# Altium project TRAVEH.PRJPCB
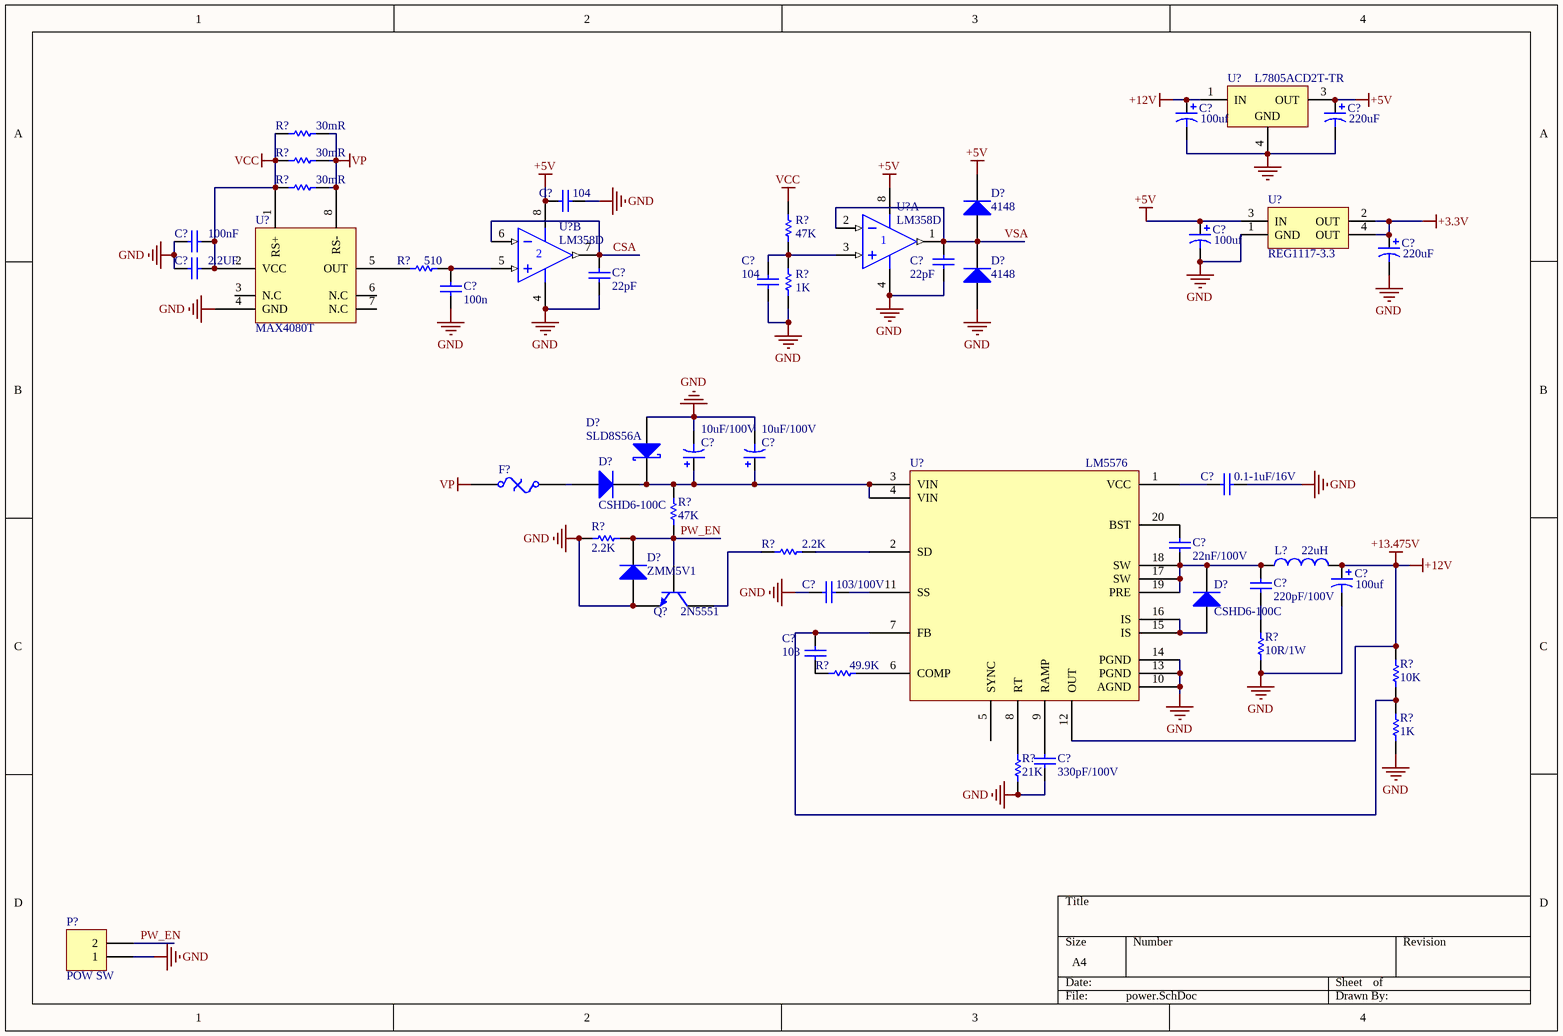
[diagram p0: power.SchDoc]
6 sheets, 138 parts. Net scope: global (net labels, ports and power ports of the same name join across sheets).
Board file: V1.1.PcbDoc
Sheets:
  power.SchDoc
  core.SchDoc
  signal.SchDoc
  hydraulic.SchDoc
  interface.SchDoc
  edison.SchDoc

## Sheet power.SchDoc
size A4

### Parts
(Parts that share a designator on the sheet are numbered #1, #2 ... from top to bottom, then left to right.)
C21  value 104  [0603]  (hidden comment: Cap)
C22  value 100nF  [R0805]  (hidden comment: Cap)
C23  value 2.2UF  [C-5.08]  (hidden comment: Cap)
C24  value 104  [0603]  (hidden comment: Cap)
C25  value 22pF  [0603]  (hidden comment: Cap)
C26  value 22pF  [0603]  (hidden comment: Cap)
C27  value 100n  [0603]  (hidden comment: Cap)
C?#1  value 100uf  [C8x4]  (hidden comment: Cap Pol1)
C?#2  value 220uF  [C8x4]  (hidden comment: Cap Pol1)
C?#3  value 100uf  [C8x4]  (hidden comment: Cap Pol1)
C?#4  value 220uF  [C8x4]  (hidden comment: Cap Pol1)
C?#5  value 10uF/100V  [C10-SMD]  (hidden comment: Cap Pol3)
C?#6  value 10uF/100V  [C10-SMD]  (hidden comment: Cap Pol3)
C?#7  value 0.1-1uF/16V  [0805]  (hidden comment: Cap)
C?#8  value 22nF/100V  [0805]  (hidden comment: Cap)
C?#9  value 100uf  [C8x4]  (hidden comment: Cap Pol1)
C?#10  value 220pF/100V  [0603]  (hidden comment: Cap)
C?#11  value 103/100V  [0603]  (hidden comment: Cap)
C?#12  value 103  [0603]  (hidden comment: Cap)
C?#13  value 330pF/100V  [0603]  (hidden comment: Cap)
D11  4148  [LL34]
D12  4148  [LL34]
D?#1  SLD8S56A  [SMTO-263]
D?#2  CSHD6-100C  [LL34]
D?#3  ZMM5V1  [LL34]
D?#4  CSHD6-100C  [LL34]
F?  Fuse Thermal  [FUSE-PTC]  (value not drawn)
L?#1  value 22uH  [L-6045]  (hidden comment: Inductor)
P?#1  POW SW  [HDR1X2]
Q?#1  value 2N5551  [SOT-23-NPN]  (hidden comment: NPN)
R50  value 30mR  [R15-1mm]
R51  value 30mR  [R15-1mm]
R52  value 30mR  [R15-1mm]
R53  value 47K  [R0805]  (hidden comment: Res1)
R54  value 510  [0603]  (hidden comment: Res1)
R55  value 1K  [R0805]  (hidden comment: Res1)
R?#1  value 47K  [0805]  (hidden comment: Res1)
R?#2  value 2.2K  [0805]  (hidden comment: Res1)
R?#3  value 2.2K  [0805]  (hidden comment: Res1)
R?#4  value 49.9K  [0603]  (hidden comment: Res1)
R?#5  value 10R/1W  [6332[2512]]  (hidden comment: Res1)
R?#6  value 10K  [0603]  (hidden comment: Res1)
R?#7  value 1K  [0603]  (hidden comment: Res1)
R?#8  value 21K  [0603]  (hidden comment: Res1)
U4  LM358D  [SOIC8]  (part B of 2)
U5  MAX4080T  [SOIC8]
U6  LM5576  [HTTSOP-20]
U?#1  L7805ACD2T-TR  [D2PAK]
U?#2  REG1117-3.3  [ZZ311]
U?#3  LM358D  [SOIC8]  (part A of 2)

### Nets
+3.3V: C?#4.1 U?#2.2(OUT) U?#2.4(OUT)
+5V: C21.2 C?#2.1 C?#3.1 D11.2(K) U4.8(V+) U?#1.3(OUT) U?#2.3(IN) U?#3.8(V+)
+12V: C?#1.1 C?#9.1 L?#1.2 R?#6.2 U6.12(OUT) U?#1.1(IN)  [also labelled +13.475V]
GND: C21.1 C22.1 C23.2 C24.2 C25.1 C26.1 C27.1 C?#1.2 C?#2.2 C?#3.2 C?#4.2 C?#5.2 C?#6.2 C?#7.1 C?#9.2 C?#11.2 C?#13.1 D12.1(A) D?#1.2(A) D?#3.1(A) P?#1.1 Q?#1.1(E) R55.1 R?#2.1 R?#5.1 R?#7.1 R?#8.1 U4.4(V-) U5.4(GND) U6.10(AGND) U6.13(PGND) U6.14(PGND) U?#1.2(GND) U?#1.4(GND) U?#2.1(GND) U?#3.4(V-)
VCC: C22.2 C23.1 R50.2 R51.2 R52.2 R53.2 U5.1(RS+) U5.2(VCC)
VP: F?.1 R50.1 R51.1 R52.1 U5.8(RS-)
CSA: C26.2 U4.6(IN-) U4.7(OUT)
PW_EN: D?#3.2(K) P?#1.2 Q?#1.2(B) R?#1.2 R?#2.2
VSA: C25.2 D11.1(A) D12.2(K) U?#3.1(OUT) U?#3.2(IN-)
NetC24_1: C24.1 R53.1 R55.2 U?#3.3(IN+)
NetC27_2: C27.2 R54.1 U4.5(IN+)
NetC?#5_1: C?#5.1 C?#6.1 D?#1.1(K) D?#2.2(K) R?#1.1 U6.3(VIN) U6.4(VIN)
NetC?#7_2: C?#7.2 U6.1(VCC)
NetC?#8_1: C?#8.1 U6.20(BST)
NetC?#8_2: C?#8.2 C?#10.2 D?#4.2(K) L?#1.1 U6.17(SW) U6.18(SW) U6.19(PRE)
NetC?#10_1: C?#10.1 R?#5.2
NetC?#11_1: C?#11.1 U6.11(SS)
NetC?#12_1: C?#12.1 R?#6.1 R?#7.2 U6.7(FB)
NetC?#12_2: C?#12.2 R?#4.1
NetC?#13_2: C?#13.2 U6.9(RAMP)
NetD?#2_1: D?#2.1(A) F?.2
NetD?#4_1: D?#4.1(A) U6.15(IS) U6.16(IS)
NetQ?#1_3: Q?#1.3(C) R?#3.1
NetR54_2: R54.2 U5.5(OUT)
NetR?#3_2: R?#3.2 U6.2(SD)
NetR?#4_2: R?#4.2 U6.6(COMP)
NetR?#8_2: R?#8.2 U6.8(RT)

Not connected (* = marked no-connect by the designer): U5 3(N.C) 6(N.C) 7(N.C); U6 5(SYNC)

### Library data of the parts
C21-C27 C?#7 C?#8 C?#10-C?#13 = Cap: Capacitor; Published: 8-Jun-2000; LatestRevisionDate: 17-Jul-2002; LatestRevisionNote: Re-released for DXP Platform.; PackageReference: RB7.6-15; Publisher: Altium Limited
C?#1-C?#4 C?#9 = Cap Pol1: Polarized Capacitor (Radial); Published: 8-Jun-2000; LatestRevisionDate: 17-Jul-2002; LatestRevisionNote: Re-released for DXP Platform.; PackageReference: RAD-0.3; Publisher: Altium Limited
C?#5 C?#6 = Cap Pol3: Polarized Capacitor (Surface Mount); Published: 8-Jun-2000; LatestRevisionDate: 17-Jul-2002; LatestRevisionNote: Re-released for DXP Platform.; PackageReference: C0805; Publisher: Altium Limited
D11 D12 D?#2-D?#4 = Diode 1N5408: 3 Amp Medium Power Silicon Rectifier Diode; Value: 1N4148; Published: 8-Jun-2000; LatestRevisionDate: 17-Jul-2002; LatestRevisionNote: Re-released for DXP Platform.; DatasheetDocument: Aug-1984; PackageReference: DO-201AD; Publisher: Altium Limited; ComponentLink1Description: Manufacturer Link; ComponentLink1URL: http://www.irf.com/
D?#1 = Diode 18TQ045: Schottky Rectifier; Note: Terminal 2 is the TAB and is electrically connected to the cathode; Value: SMBJ45CA; Published: 8-Jun-2000; LatestRevisionDate: 17-Jul-2002; LatestRevisionNote: Re-released for DXP Platform.; DatasheetDocument: Dec-1997; PackageDocument: Feb-1998; PackageReference: TO-220AC; Publisher: Altium Limited; ComponentLink1Description: Manufacturer Link; ComponentLink1URL: http://www.irf.com/; ComponentLink2Description: Datasheet; ComponentLink2URL: http://www.irf.com/product-info/datasheets/data/18tq.pdf
F? = Fuse Thermal: Thermal Fuse; Published: 24-Mar-1999; LatestRevisionDate: 17-Jul-2002; LatestRevisionNote: Re-released for DXP Platform.; PackageReference: PIN-W2/E2.8; Publisher: Altium Limited
L?#1 = Inductor: Code_IEC: 1005; Published: 8-Jun-2000; LatestRevisionDate: 17-Jul-2002; LatestRevisionNote: Re-released for DXP Platform.; PackageReference: 0402-A; Publisher: Altium Limited; Code_JEITA: 0402
P?#1 = Header 2: Header, 2-Pin; LatestRevisionDate: 17-Jul-2002; LatestRevisionNote: Re-released for DXP Platform.; Publisher: Altium Limited
Q?#1 = 2N5551: NPN General Purpose Amplifier; Published: 8-Jun-2000; LatestRevisionDate: 17-Jan-2003; LatestRevisionNote: PCB Footprint 'BCY-W3/D4.7' replaced; DatasheetDocument: 1997; PackageDocument: Sep-1998; PackageReference: TO-92A; Publisher: Altium Limited; ComponentLink1Description: Manufacturer Link; ComponentLink1URL: http://www.fairchildsemi.com/; ComponentLink2Description: Datasheet; ComponentLink2URL: http://www.fairchildsemi.com/ds/2N%2F2N5551.pdf
R50-R55 R?#1-R?#8 = Res1: Resistor
U4 U?#3 = LM358D: Dual Low-Power Operational Amplifier
U5 = MAX4080
U?#1 = MC78M05ACDTRK: Three-Terminal Medium Current Positive Voltage Regulator; Note: Pin 2 is electrically connected to Pin 4; Pin 2 is trimmed and not drawn;; Published: 15-Apr-2002; DatasheetVersion: Apr-2000; PackageVersion: 1997; PackageReference: 369A-13; Publisher: Altium Limited; PackageDescription: D-PAK/TO-252-AA; 3 Leads (1 Cropped); Body 10.3 (inc. leads) x 6.7 mm (LxW max); ComponentLink1Description: Manufacturer Link; ComponentLink1URL: http://www.onsemi.com/site/products/taxonomy/0,4438,503,00.html; ComponentLink2Description: Datasheet; ComponentLink2URL: http://www.onsemi.com/pub/Collateral/MC78M00-D.PDF
U?#2 = REG1117-3.3: 800mA and 1A Low Dropout Positive Regulator 2.85V, 3.3V, 5V, and Adjustable; Published: 8-Jun-2000; LatestRevisionDate: 17-Jul-2002; LatestRevisionNote: Re-released for DXP Platform.; DatasheetVersion: Sep-1997; PackageVersion: revC; PackageReference: ZZ311; Publisher: Altium Limited; PackageDescription: SOT-223/SC-73; 4 Leads; Body 6.7 x 7.3 mm, inc. leads (LxW max); ComponentLink1Description: Manufacturer Link; ComponentLink1URL: http://www.ti.com/; ComponentLink2Description: Datasheet; ComponentLink2URL: http://www-s.ti.com/sc/ds/REG1117.pdf

## Sheet core.SchDoc
size A4
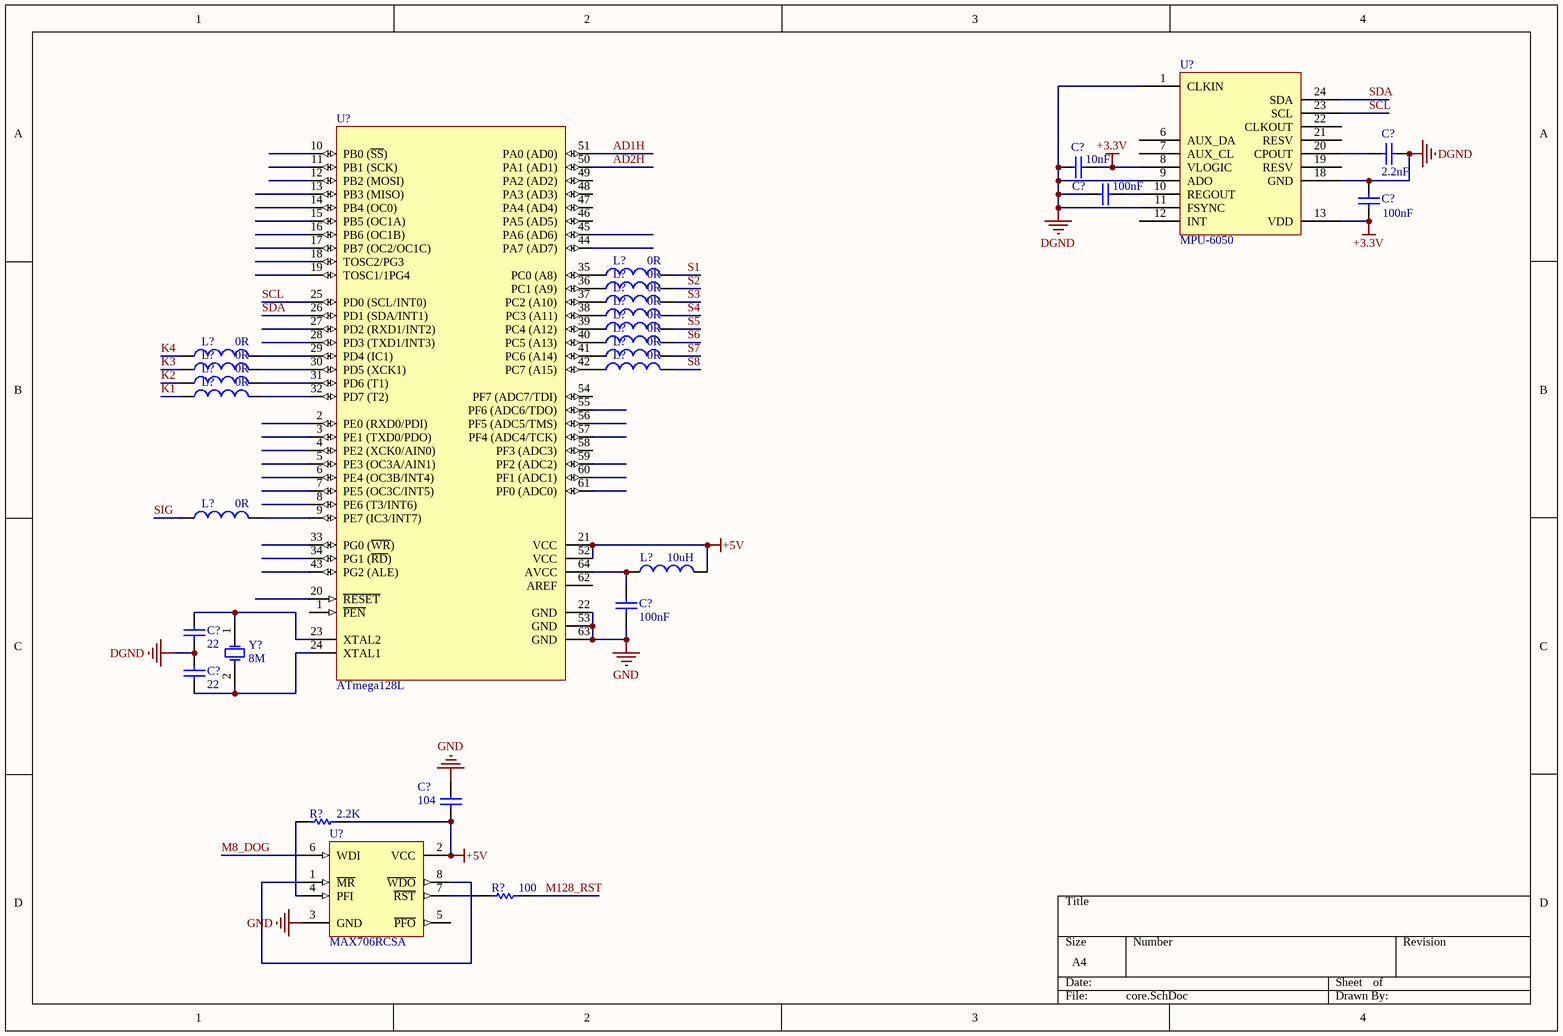
[diagram p1: core.SchDoc]

### Parts
(Parts that share a designator on the sheet are numbered #1, #2 ... from top to bottom, then left to right.)
C?#14  value 10nF  [0603]  (hidden comment: Cap)
C?#15  value 2.2nF  [0603]  (hidden comment: Cap)
C?#16  value 100nF  [0603]  (hidden comment: Cap)
C?#17  value 100nF  [0603]  (hidden comment: Cap)
C?#18  value 100nF  [0603]  (hidden comment: Cap)
C?#19  value 22  [0603]  (hidden comment: Cap)
C?#20  value 22  [0603]  (hidden comment: Cap)
C?#21  value 104  [0603]  (hidden comment: Cap)
L16  value 10uH  [0603]  (hidden comment: Inductor)
L19  value 0R  [0603]  (hidden comment: Inductor)
L?#2  value 0R  [0603]  (hidden comment: Inductor)
L?#3  value 0R  [0603]  (hidden comment: Inductor)
L?#4  value 0R  [0603]  (hidden comment: Inductor)
L?#5  value 0R  [0603]  (hidden comment: Inductor)
L?#6  value 0R  [0603]  (hidden comment: Inductor)
L?#7  value 0R  [0603]  (hidden comment: Inductor)
L?#8  value 0R  [0603]  (hidden comment: Inductor)
L?#9  value 0R  [0603]  (hidden comment: Inductor)
L?#10  value 0R  [0603]  (hidden comment: Inductor)
L?#11  value 0R  [0603]  (hidden comment: Inductor)
L?#12  value 0R  [0603]  (hidden comment: Inductor)
L?#13  value 0R  [0603]  (hidden comment: Inductor)
R?#9  value 2.2K  [0603]  (hidden comment: Res1)
R?#10  value 100  [0603]  (hidden comment: Res1)
U?#4  value ATmega128L  [64A_N]  (hidden comment: IC)
U?#5  value MPU-6050  [QFN50P400X400X95-24N]  (hidden comment: GYRO)
U?#6  MAX706RCSA  [SOIC8]
Y?  value 8M  [49SD]  (hidden comment: XTAL)

### Nets
+3.3V: C?#14.2 C?#17.1 U?#5.8(VLOGIC) U?#5.13(VDD)
+5V: C?#21.2 L16.2 R?#9.2 U?#4.21(VCC) U?#4.52(VCC) U?#6.2(VCC)
DGND: C?#14.1 C?#15.1 C?#16.2 C?#17.2 C?#19.1 C?#20.2 U?#5.1(CLKIN) U?#5.9(ADO) U?#5.11(FSYNC) U?#5.18(GND)
GND: C?#18.1 C?#21.1 U?#4.22(GND) U?#4.53(GND) U?#4.63(GND) U?#6.3(GND)
AD1H: U?#4.51(PA0_(AD0))
AD2H: U?#4.50(PA1_(AD1))
K1: L?#12.1
K2: L?#11.1
K3: L?#9.1
K4: L19.1
M8_DOG: U?#6.6(WDI)
M128_RST: R?#10.2
S1: L?#2.2
S2: L?#3.2
S3: L?#4.2
S4: L?#5.2
S5: L?#6.2
S6: L?#7.2
S7: L?#8.2
S8: L?#10.2
SCL: U?#4.25(PD0_(SCL/INT0)) U?#5.23(SCL)
SDA: U?#4.26(PD1_(SDA/INT1)) U?#5.24(SDA)
SIG: L?#13.1
NetC?#15_2: C?#15.2 U?#5.20(CPOUT)
NetC?#16_1: C?#16.1 U?#5.10(REGOUT)
NetC?#18_2: C?#18.2 L16.1 U?#4.64(AVCC)
NetC?#19_2: C?#19.2 U?#4.23(XTAL2) Y?.1(OSC1)
NetC?#20_1: C?#20.1 U?#4.24(XTAL1) Y?.2(OSC2)
NetL19_2: L19.2 U?#4.29(PD4_(IC1))
NetL?#2_1: L?#2.1 U?#4.35(PC0_(A8))
NetL?#3_1: L?#3.1 U?#4.36(PC1_(A9))
NetL?#4_1: L?#4.1 U?#4.37(PC2_(A10))
NetL?#5_1: L?#5.1 U?#4.38(PC3_(A11))
NetL?#6_1: L?#6.1 U?#4.39(PC4_(A12))
NetL?#7_1: L?#7.1 U?#4.40(PC5_(A13))
NetL?#8_1: L?#8.1 U?#4.41(PC6_(A14))
NetL?#9_2: L?#9.2 U?#4.30(PD5_(XCK1))
NetL?#10_1: L?#10.1 U?#4.42(PC7_(A15))
NetL?#11_2: L?#11.2 U?#4.31(PD6_(T1))
NetL?#12_2: L?#12.2 U?#4.32(PD7_(T2))
NetL?#13_2: L?#13.2 U?#4.9(PE7_(IC3/INT7))
NetR?#9_1: R?#9.1 U?#6.4(PFI)
NetR?#10_1: R?#10.1 U?#6.7(~{RST})
NetU?#6_1: U?#6.1(~{MR}) U?#6.8(~{WDO})

Not connected (* = marked no-connect by the designer): U?#4 1(~{PEN}) 2(PE0_(RXD0/PDI)) 3(PE1_(TXD0/PDO)) 4(PE2_(XCK0/AIN0)) 5(PE3_(OC3A/AIN1)) 6(PE4_(OC3B/INT4)) 7(PE5_(OC3C/INT5)) 8(PE6_(T3/INT6)) 10(PB0_(~{SS})) 11(PB1_(SCK)) 12(PB2_(MOSI)) 13(PB3_(MISO)) 14(PB4_(OC0)) 15(PB5_(OC1A)) 16(PB6_(OC1B)) 17(PB7_(OC2/OC1C)) 18(TOSC2/PG3) 19(TOSC1/1PG4) 20(~{RESET}) 27(PD2_(RXD1/INT2)) 28(PD3_(TXD1/INT3)) 33(PG0_(~{WR})) 34(PG1_(~{RD})) 43(PG2_(ALE)) 44(PA7_(AD7)) 45(PA6_(AD6)) 46(PA5_(AD5)) 47(PA4_(AD4)) 48(PA3_(AD3)) 49(PA2_(AD2)) 54(PF7_(ADC7/TDI)) 55(PF6_(ADC6/TDO)) 56(PF5_(ADC5/TMS)) 57(PF4_(ADC4/TCK)) 58(PF3_(ADC3)) 59(PF2_(ADC2)) 60(PF1_(ADC1)) 61(PF0_(ADC0)) 62(AREF); U?#5 6(AUX_DA) 7(AUX_CL) 12(INT) 19(RESV) 21(RESV) 22(CLKOUT); U?#6 5(~{PFO})

### Library data of the parts
C?#14-C?#21 = Cap: Capacitor; Published: 8-Jun-2000; LatestRevisionDate: 17-Jul-2002; LatestRevisionNote: Re-released for DXP Platform.; PackageReference: RAD-0.3; Publisher: Altium Limited
L16 L19 L?#2-L?#13 = Inductor: Code_IEC: 1005; Published: 8-Jun-2000; LatestRevisionDate: 17-Jul-2002; LatestRevisionNote: Re-released for DXP Platform.; PackageReference: 0402-A; Publisher: Altium Limited; Code_JEITA: 0402
R?#9 R?#10 = Res1: Resistor; Published: 8-Jun-2000; LatestRevisionDate: 17-Jul-2002; LatestRevisionNote: Re-released for DXP Platform.; PackageReference: AXIAL-0.3; Publisher: Altium Limited
U?#4 = ATmega128L-8AI: 8-Bit AVR Microcontroller with 128K Bytes of In-System Programmable Flash Memory; Published: 17-Sep-2003; LatestRevisionDate: 13-Apr-2006; LatestRevisionNote: IPC-7351 Footprint Added.; DatasheetVersion: 2467G-AVR-09/02; PackageVersion: revB, Oct-2001; PackageReference: 64A; Publisher: Altium Limited; PackageDescription: 64-Pin Thin Quad Flat Pack 0.8 mm Pitch; Code_JEDEC: MS-026-AEB; ComponentLink1Description: Manufacturer Link; ComponentLink1URL: http://www.atmel.com; ComponentLink2Description: Datasheet; ComponentLink2URL: http://www.atmel.com/dyn/resources/prod_documents/doc2467.pdf
U?#5 = MPU-6000
U?#6 = MAX706RCSA: +3V Voltage Monitoring, Low-Cost, µP Supervisory Circuit; Published: 16-Jan-2001; LatestRevisionDate: 13-Apr-2006; LatestRevisionNote: IPC-7351 Footprint Added.; DatasheetVersion: Sep-1995; PackageReference: NSO8; Publisher: Altium Limited; PackageDescription: 8-Pin Small Outline Integrated Circuit 1.27 mm Pitch; Code_JEDEC: MS-012-AA; Code_IPC: SOIC127P600-8; ComponentLink1Description: Manufacturer Link; ComponentLink1URL: http://www.maxim-ic.com/; ComponentLink2Description: Datasheet; ComponentLink2URL: http://pdfserv.maxim-ic.com/en/ds/MAX706P-MAX708T.pdf
Y? = XTAL: Crystal Oscillator; Published: 8-Jun-2000; LatestRevisionDate: 17-Jul-2002; LatestRevisionNote: Re-released for DXP Platform.; PackageReference: R38; Publisher: Altium Limited

## Sheet signal.SchDoc
size A4
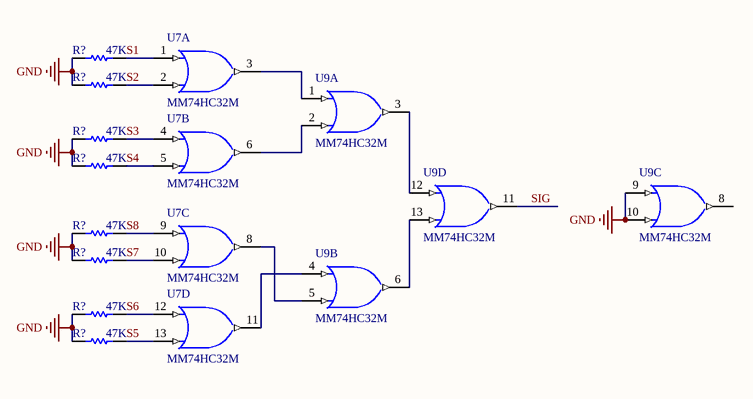
[diagram p2: signal.SchDoc]

### Parts
(Parts that share a designator on the sheet are numbered #1, #2 ... from top to bottom, then left to right.)
R?#11  value 47K  [0603]  (hidden comment: Res1)
R?#12  value 47K  [0603]  (hidden comment: Res1)
R?#13  value 47K  [0603]  (hidden comment: Res1)
R?#14  value 47K  [0603]  (hidden comment: Res1)
R?#15  value 47K  [0603]  (hidden comment: Res1)
R?#16  value 47K  [0603]  (hidden comment: Res1)
R?#17  value 47K  [0603]  (hidden comment: Res1)
R?#18  value 47K  [0603]  (hidden comment: Res1)
U7  MM74HC32M  [M14A_N]  (parts A,B,C,D of 4)
U9  MM74HC32M  [M14A_N]  (parts A,B,C,D of 4)

### Nets
+5V: U7.14(VCC) U9.14(VCC)
GND: R?#11.1 R?#12.1 R?#13.1 R?#14.1 R?#15.1 R?#16.1 R?#17.1 R?#18.1 U7.7(GND) U9.7(GND) U9.9(A) U9.10(B)
S1: R?#11.2 U7.1(A)
S2: R?#12.2 U7.2(B)
S3: R?#13.2 U7.4(A)
S4: R?#14.2 U7.5(B)
S5: R?#18.2 U7.13(B)
S6: R?#17.2 U7.12(A)
S7: R?#16.2 U7.10(B)
S8: R?#15.2 U7.9(A)
SIG: U9.11(Y)
NetU7_3: U7.3(Y) U9.1(A)
NetU7_6: U7.6(Y) U9.2(B)
NetU7_8: U7.8(Y) U9.5(B)
NetU7_11: U7.11(Y) U9.4(A)
NetU9_3: U9.3(Y) U9.12(A)
NetU9_6: U9.6(Y) U9.13(B)

Not connected (* = marked no-connect by the designer): U9 8(Y)

### Library data of the parts
R?#11-R?#18 = Res1: Resistor; Published: 8-Jun-2000; LatestRevisionDate: 17-Jul-2002; LatestRevisionNote: Re-released for DXP Platform.; PackageReference: AXIAL-0.3; Publisher: Altium Limited
U7 U9 = MM74HC32M: Quad 2-Input OR Gate; Published: 15-Apr-2002; LatestRevisionDate: 13-Apr-2006; LatestRevisionNote: IPC-7351 Footprint Added.; DatasheetVersion: 1988; PackageVersion: 2000; PackageReference: M14A; Publisher: Altium Limited; PackageDescription: 14-Pin Small Outline Integrated Circuit 1.27 mm Pitch; Code_IPC: SOIC127P600-14; ComponentLink1Description: Manufacturer Link; ComponentLink1URL: http://www.national.com/; ComponentLink2Description: Datasheet; ComponentLink2URL: http://www.fairchildsemi.com/ds/MM/MM74HC32.pdf; ComponentLink3Description: URL Link1; ComponentLink3URL: http://www.fairchildsemi.com/pf/MM/MM74HC32.html

## Sheet hydraulic.SchDoc
size A4
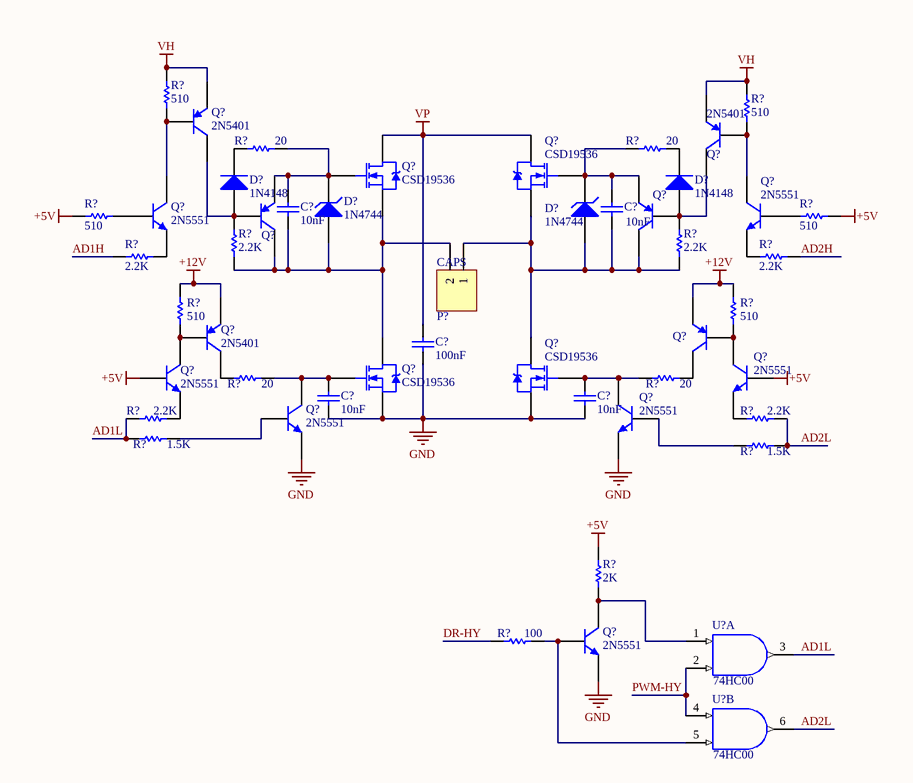
[diagram p3: hydraulic.SchDoc]

### Parts
(Parts that share a designator on the sheet are numbered #1, #2 ... from top to bottom, then left to right.)
C?#22  value 10nF  [R0805]  (hidden comment: Cap)
C?#23  value 10nF  [R0805]  (hidden comment: Cap)
C?#24  value 100nF  [C-5.08]  (hidden comment: Cap)
C?#25  value 10nF  [R0805]  (hidden comment: Cap)
C?#26  value 10nF  [R0805]  (hidden comment: Cap)
D?#5  1N4148  [LL34]
D?#6  1N4148  [LL34]
D?#7  1N4744  [LL34]
D?#8  1N4744  [LL34]
P?#2  CAPS  [MG7.62-2P]
Q?#2  2N5401  [SOT-23-PNP]
Q?#3  2N5401  [SOT-23-PNP]
Q?#4  CSD19536  [D2PAK]
Q?#5  CSD19536  [D2PAK]
Q?#6  2N5551  [SOT-23-NPN]
Q?#7  2N5401  [SOT-23-PNP]  (value not drawn)
Q?#8  2N5401  [SOT-23-PNP]  (value not drawn)
Q?#9  2N5551  [SOT-23-NPN]
Q?#10  2N5401  [SOT-23-PNP]
Q?#11  2N5401  [SOT-23-PNP]  (value not drawn)
Q?#12  2N5551  [SOT-23-NPN]
Q?#13  CSD19536  [D2PAK]
Q?#14  CSD19536  [D2PAK]
Q?#15  2N5551  [SOT-23-NPN]
Q?#16  2N5551  [SOT-23-NPN]
Q?#17  2N5551  [SOT-23-NPN]
Q?#18  2N5551  [SOT-23-NPN]
R?#19  value 510  [R0805]  (hidden comment: Res1)
R?#20  value 510  [R0805]  (hidden comment: Res1)
R?#21  value 20  [R0805]  (hidden comment: Res1)
R?#22  value 20  [R0805]  (hidden comment: Res1)
R?#23  value 510  [R0805]  (hidden comment: Res1)
R?#24  value 510  [R0805]  (hidden comment: Res1)
R?#25  value 2.2K  [R0805]  (hidden comment: Res1)
R?#26  value 2.2K  [R0805]  (hidden comment: Res1)
R?#27  value 2.2K  [R0805]  (hidden comment: Res1)
R?#28  value 2.2K  [R0805]  (hidden comment: Res1)
R?#29  value 510  [R0805]  (hidden comment: Res1)
R?#30  value 510  [R0805]  (hidden comment: Res1)
R?#31  value 20  [R0805]  (hidden comment: Res1)
R?#32  value 20  [R0805]  (hidden comment: Res1)
R?#33  value 2.2K  [R0805]  (hidden comment: Res1)
R?#34  value 2.2K  [R0805]  (hidden comment: Res1)
R?#35  value 1.5K  [R0805]  (hidden comment: Res1)
R?#36  value 1.5K  [R0805]  (hidden comment: Res1)
R?#37  value 2K  [0603]  (hidden comment: Res1)
R?#38  value 100  [0603]  (hidden comment: Res1)
U?#7  value 74HC00  [751A]  (hidden comment: IC)  (part A of 4)
U?#8  value 74HC00  [751A]  (hidden comment: IC)  (part B of 4)

### Nets
+5V: Q?#12.2(B) Q?#15.2(B) R?#23.2 R?#24.2 R?#37.2
+12V: Q?#10.1(E) Q?#11.1(E) R?#29.1 R?#30.1
DGND: U?#7.7(GND) U?#8.7(GND)
GND: C?#24.2 C?#25.2 C?#26.2 Q?#13.3(S) Q?#14.3(S) Q?#16.1(E) Q?#17.1(E) Q?#18.1(E)
VDD: U?#7.14(VDD) U?#8.14(VDD)
VH: Q?#2.1(E) Q?#3.1(E) R?#19.2 R?#20.2
VP: C?#24.1 Q?#4.2(D) Q?#5.2(D)
AD1H: R?#25.1
AD1L: R?#33.1 R?#35.2 U?#7.3(Y)
AD2H: R?#26.2
AD2L: R?#34.2 R?#36.1 U?#8.6(Y)
DR-HY: R?#38.2
PWM-HY: U?#7.2(B) U?#8.4(A)
NetC?#22_1: C?#22.1 D?#7.2(K) Q?#4.1(G) Q?#7.1(E) R?#21.2
NetC?#22_2: C?#22.2 D?#7.1(A) P?#2.2 Q?#4.3(S) Q?#7.3(C) Q?#13.2(D) R?#27.1
NetC?#23_1: C?#23.1 D?#8.2(K) Q?#5.1(G) Q?#8.1(E) R?#22.1
NetC?#23_2: C?#23.2 D?#8.1(A) P?#2.1 Q?#5.3(S) Q?#8.3(C) Q?#14.2(D) R?#28.1
NetC?#25_1: C?#25.1 Q?#13.1(G) Q?#16.3(C) R?#31.2
NetC?#26_1: C?#26.1 Q?#14.1(G) Q?#17.3(C) R?#32.1
NetD?#5_1: D?#5.1(A) Q?#2.3(C) Q?#7.2(B) R?#27.2
NetD?#5_2: D?#5.2(K) R?#21.1
NetD?#6_1: D?#6.1(A) Q?#3.3(C) Q?#8.2(B) R?#28.2
NetD?#6_2: D?#6.2(K) R?#22.2
NetQ?#2_2: Q?#2.2(B) Q?#6.3(C) R?#19.1
NetQ?#3_2: Q?#3.2(B) Q?#9.3(C) R?#20.1
NetQ?#6_1: Q?#6.1(E) R?#25.2
NetQ?#6_2: Q?#6.2(B) R?#24.1
NetQ?#9_1: Q?#9.1(E) R?#26.1
NetQ?#9_2: Q?#9.2(B) R?#23.1
NetQ?#10_2: Q?#10.2(B) Q?#12.3(C) R?#29.2
NetQ?#10_3: Q?#10.3(C) R?#31.1
NetQ?#11_2: Q?#11.2(B) Q?#15.3(C) R?#30.2
NetQ?#11_3: Q?#11.3(C) R?#32.2
NetQ?#12_1: Q?#12.1(E) R?#33.2
NetQ?#15_1: Q?#15.1(E) R?#34.1
NetQ?#16_2: Q?#16.2(B) R?#35.1
NetQ?#17_2: Q?#17.2(B) R?#36.2
NetQ?#18_2: Q?#18.2(B) R?#38.1 U?#8.5(B)
NetQ?#18_3: Q?#18.3(C) R?#37.1 U?#7.1(A)

### Library data of the parts
C?#22-C?#26 = Cap: Capacitor; Published: 8-Jun-2000; LatestRevisionDate: 17-Jul-2002; LatestRevisionNote: Re-released for DXP Platform.; PackageReference: RAD-0.3; Publisher: Altium Limited
D?#5 D?#6 = Diode 1N4148: High Conductance Fast Diode; Published: 8-Jun-2000; LatestRevisionDate: 17-Jul-2002; LatestRevisionNote: Re-released for DXP Platform.; DatasheetDocument: 1997; PackageReference: DO-35; Publisher: Altium Limited; Code_JEDEC: DO-204-AH; ComponentLink1Description: Manufacturer Link; ComponentLink1URL: http://www.fairchildsemi.com/; ComponentLink2Description: Datasheet; ComponentLink2URL: http://www.fairchildsemi.com/ds/1N%2F1N4148.pdf
D?#7 D?#8 = D Zener: Zener Diode; Published: 8-Jun-2000; LatestRevisionDate: 17-Jul-2002; LatestRevisionNote: Re-released for DXP Platform.; PackageReference: DIODE-0.7; Publisher: Altium Limited
P?#2 = Header 2: Header, 2-Pin; LatestRevisionDate: 17-Jul-2002; LatestRevisionNote: Re-released for DXP Platform.; Publisher: Altium Limited
Q?#2 Q?#3 Q?#7 Q?#8 Q?#10 Q?#11 = 2N5401: PNP General Purpose Amplifier; Published: 8-Jun-2000; LatestRevisionDate: 17-Jan-2003; LatestRevisionNote: PCB Footprint 'BCY-W3/D4.7' replaced; DatasheetDocument: 1997; PackageDocument: Sep-1998; PackageReference: TO-92A; Publisher: Altium Limited; ComponentLink1Description: Manufacturer Link; ComponentLink1URL: http://www.fairchildsemi.com/; ComponentLink2Description: Datasheet; ComponentLink2URL: http://www.fairchildsemi.com/ds/2N%2F2N5401.pdf
Q?#4 Q?#5 Q?#13 Q?#14 = IRF644S: HEXFET N-Channel Power MOSFET; Published: 8-Jun-2000; LatestRevisionDate: 17-Jul-2002; LatestRevisionNote: Re-released for DXP Platform.; DatasheetVersion: PD-9.1006; PackageReference: D2PAK; Publisher: Altium Limited; PackageDescription: D2-PAK/TO-263-AB; 3 Leads (1 Cropped); Body 15.5 (inc. leads) x 10.5 mm (LxW max); ComponentLink1Description: Manufacturer Link; ComponentLink1URL: http://www.irf.com/; ComponentLink2Description: Datasheet; ComponentLink2URL: http://www.irf.com/product-info/datasheets/data/irf644s.pdf
Q?#6 Q?#9 Q?#12 Q?#15-Q?#18 = 2N5551: NPN General Purpose Amplifier; Published: 8-Jun-2000; LatestRevisionDate: 17-Jan-2003; LatestRevisionNote: PCB Footprint 'BCY-W3/D4.7' replaced; DatasheetDocument: 1997; PackageDocument: Sep-1998; PackageReference: TO-92A; Publisher: Altium Limited; ComponentLink1Description: Manufacturer Link; ComponentLink1URL: http://www.fairchildsemi.com/; ComponentLink2Description: Datasheet; ComponentLink2URL: http://www.fairchildsemi.com/ds/2N%2F2N5551.pdf
R?#19-R?#38 = Res1: Resistor; Published: 8-Jun-2000; LatestRevisionDate: 17-Jul-2002; LatestRevisionNote: Re-released for DXP Platform.; PackageReference: AXIAL-0.3; Publisher: Altium Limited
U?#7 U?#8 = MC74HC08AD: Quad 2-Input AND Gate; Published: 17-Jul-2002; LatestRevisionDate: 13-Apr-2006; LatestRevisionNote: IPC-7351 Footprint Added.; DatasheetVersion: 1989; PackageVersion: 1991; PackageReference: 751A-02; Publisher: Altium Limited; PackageDescription: 14-Pin Small Outline Integrated Circuit 1.27 mm Pitch; Code_IPC: SOIC127P600-14; ComponentLink1Description: Manufacturer Link; ComponentLink1URL: http://www.onsemi.com/site/products/parametrics/0,4446,247,00.html; ComponentLink2Description: Ibis Model; ComponentLink2URL: http://www.onsemi.com/pub/Collateral/MC54HC08AJ.IBS

## Sheet interface.SchDoc
size A4

## Sheet edison.SchDoc
size A4
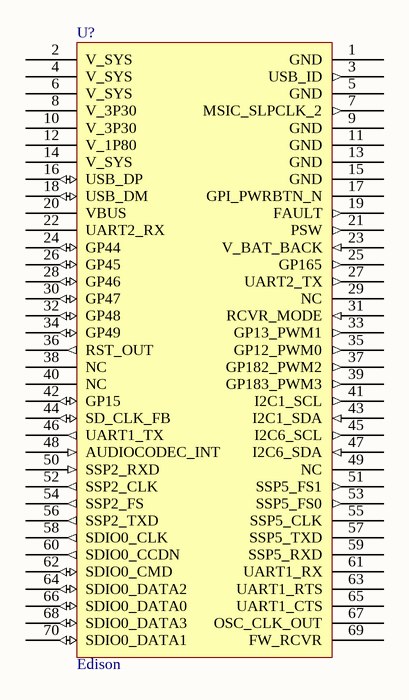
[diagram p4: edison.SchDoc]

### Parts
(Parts that share a designator on the sheet are numbered #1, #2 ... from top to bottom, then left to right.)
U?#9  Edison

### Nets

Not connected (* = marked no-connect by the designer): U?#9 1(GND) 2(V_SYS) 3(USB_ID) 4(V_SYS) 5(GND) 6(V_SYS) 7(MSIC_SLPCLK_2) 8(V_3P30) 9(GND) 10(V_3P30) 11(GND) 12(V_1P80) 13(GND) 14(V_SYS) 15(GND) 16(USB_DP) 17(GPI_PWRBTN_N) 18(USB_DM) 19(FAULT) 20(VBUS) 21(PSW) 22(UART2_RX) 23(V_BAT_BACK) 24(GP44) 25(GP165) 26(GP45) 27(UART2_TX) 28(GP46) 29(NC) 30(GP47) 31(RCVR_MODE) 32(GP48) 33(GP13_PWM1) 34(GP49) 35(GP12_PWM0) 36(RST_OUT) 37(GP182_PWM2) 38(NC) 39(GP183_PWM3) 40(NC) 41(I2C1_SCL) 42(GP15) 43(I2C1_SDA) 44(SD_CLK_FB) 45(I2C6_SCL) 46(UART1_TX) 47(I2C6_SDA) 48(AUDIOCODEC_INT) 49(NC) 50(SSP2_RXD) 51(SSP5_FS1) 52(SSP2_CLK) 53(SSP5_FS0) 54(SSP2_FS) 55(SSP5_CLK) 56(SSP2_TXD) 57(SSP5_TXD) 58(SDIO0_CLK) 59(SSP5_RXD) 60(SDIO0_CCDN) 61(UART1_RX) 62(SDIO0_CMD) 63(UART1_RTS) 64(SDIO0_DATA2) 65(UART1_CTS) 66(SDIO0_DATA0) 67(OSC_CLK_OUT) 68(SDIO0_DATA3) 69(FW_RCVR) 70(SDIO0_DATA1)

## Nets that join several sheets
+3.3V: power (C?#4.1 U?#2.2 U?#2.4), core (C?#14.2 C?#17.1 U?#5.8 U?#5.13)
+5V: power (8 pins), core (6 pins), signal (U7.14 U9.14), hydraulic (5 pins)
+12V: power (6 pins), hydraulic (Q?#10.1 Q?#11.1 R?#29.1 R?#30.1)
DGND: core (10 pins), hydraulic (U?#7.7 U?#8.7)
GND: power (36 pins), core (6 pins), signal (12 pins), hydraulic (8 pins)
VP: power (5 pins), hydraulic (C?#24.1 Q?#4.2 Q?#5.2)
AD1H: core (U?#4.51), hydraulic (R?#25.1)
AD2H: core (U?#4.50), hydraulic (R?#26.2)
S1: core (L?#2.2), signal (R?#11.2 U7.1)
S2: core (L?#3.2), signal (R?#12.2 U7.2)
S3: core (L?#4.2), signal (R?#13.2 U7.4)
S4: core (L?#5.2), signal (R?#14.2 U7.5)
S5: core (L?#6.2), signal (R?#18.2 U7.13)
S6: core (L?#7.2), signal (R?#17.2 U7.12)
S7: core (L?#8.2), signal (R?#16.2 U7.10)
S8: core (L?#10.2), signal (R?#15.2 U7.9)
SIG: core (L?#13.1), signal (U9.11)